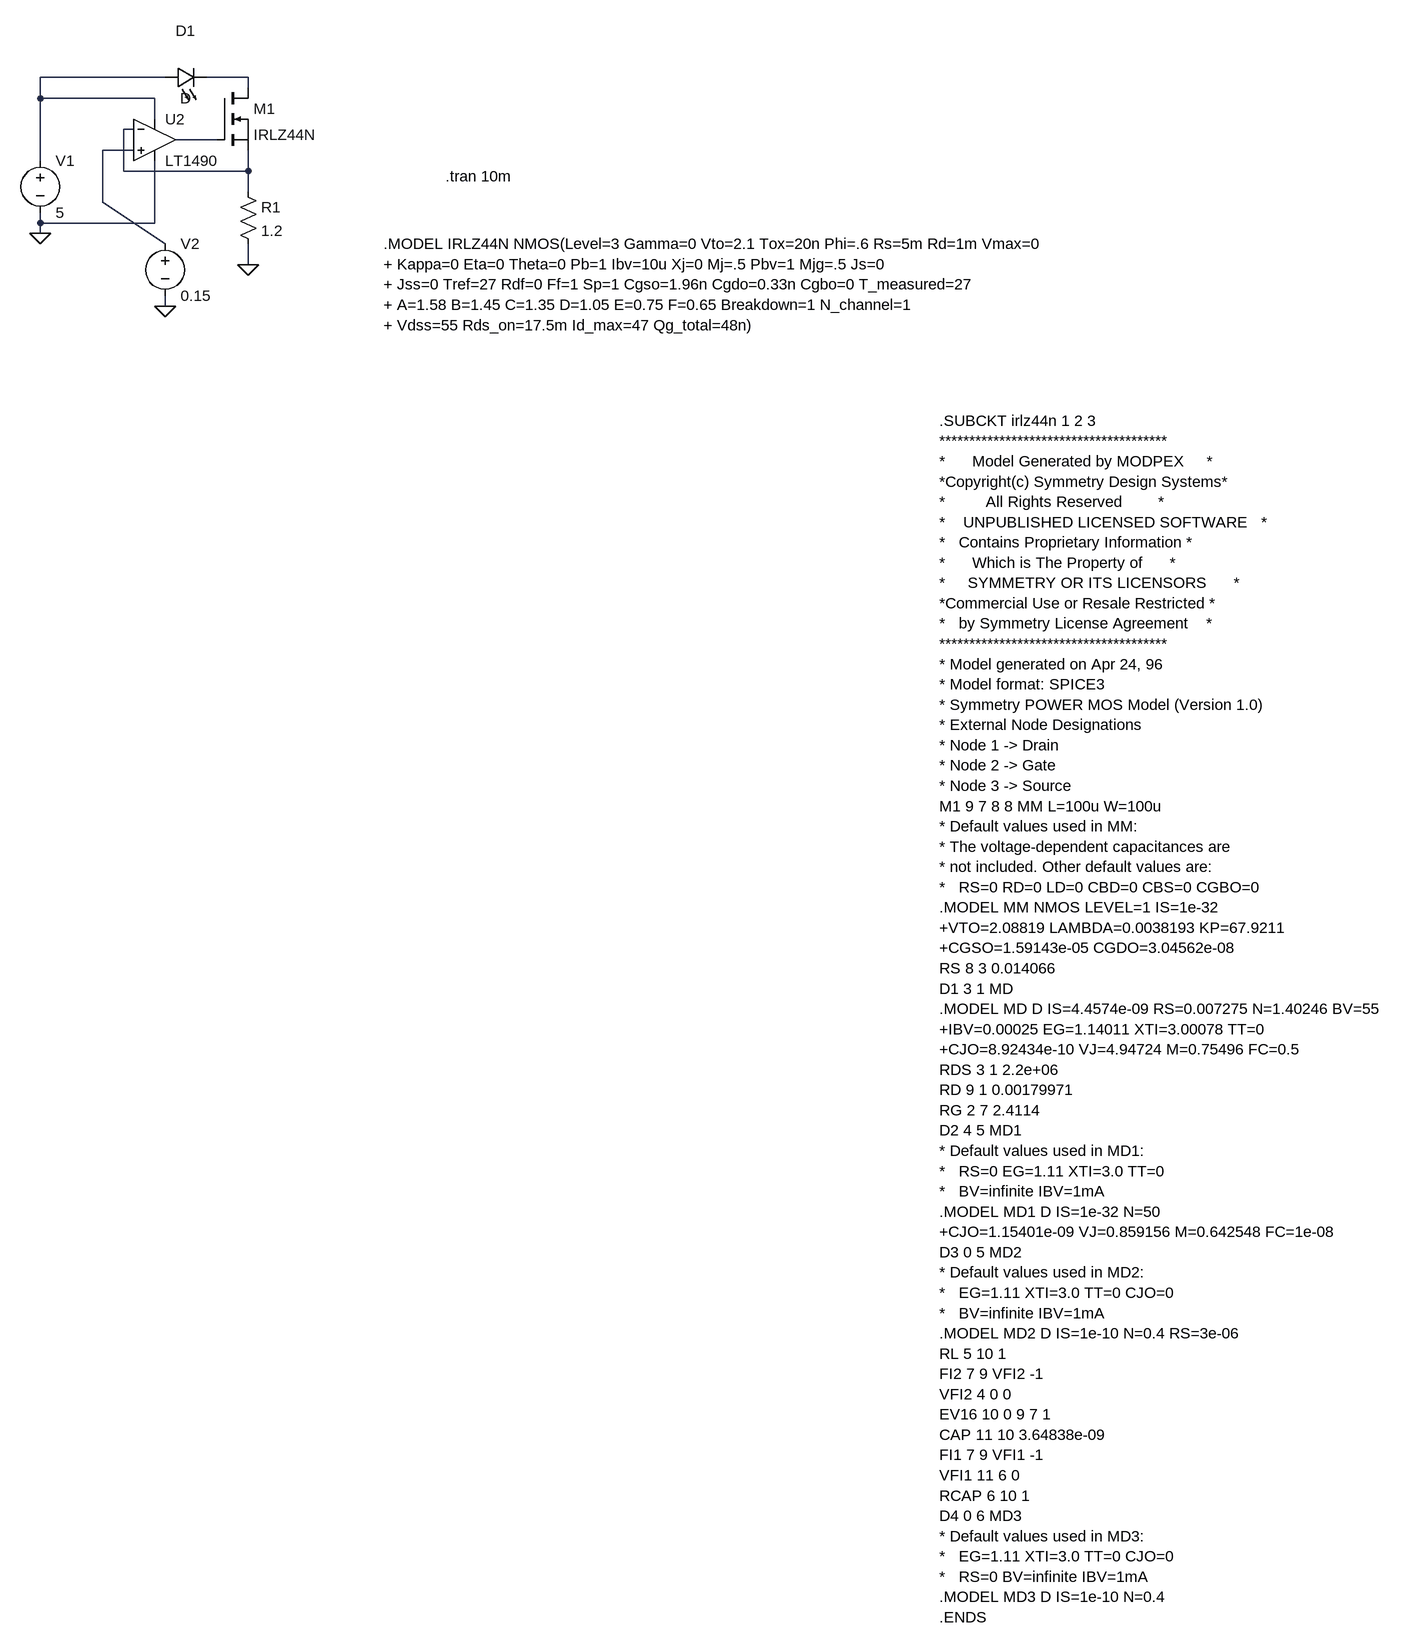
[diagram p0: schematic LED Current Driver Simulation.asc]
LED Current Driver Simulation.asc, the LTspice schematic file:
Version 4.1
SHEET 1 2040 2148
WIRE 112 -48 -80 -48
WIRE 240 -48 176 -48
WIRE 240 -32 240 -48
WIRE -80 -16 -80 -48
WIRE 96 -16 -80 -16
WIRE 96 16 96 -16
WIRE 64 32 48 32
WIRE 192 48 128 48
WIRE 64 64 16 64
WIRE -80 80 -80 -16
WIRE 48 96 48 32
WIRE 240 96 240 64
WIRE 240 96 48 96
WIRE 240 128 240 96
WIRE 16 144 16 64
WIRE -80 176 -80 160
WIRE 96 176 96 80
WIRE 96 176 -80 176
WIRE -80 192 -80 176
WIRE 112 208 16 144
WIRE 240 240 240 208
WIRE 112 304 112 288
FLAG 240 240 0
FLAG -80 192 0
FLAG 112 304 0
SYMBOL res 224 112 R0
SYMATTR InstName R1
SYMATTR Value 1.2
SYMBOL voltage -80 64 R0
WINDOW 123 0 0 Left 0
WINDOW 39 0 0 Left 0
SYMATTR InstName V1
SYMATTR Value 5
SYMBOL LED 112 -32 R270
WINDOW 0 72 32 VTop 2
WINDOW 3 0 32 VBottom 2
SYMATTR InstName D1
SYMBOL nmos 192 -32 R0
SYMATTR InstName M1
SYMATTR Value IRLZ44N
SYMATTR Prefix X
SYMBOL voltage 112 192 R0
WINDOW 123 0 0 Left 0
WINDOW 39 0 0 Left 0
SYMATTR InstName V2
SYMATTR Value 0.15
SYMBOL OpAmps\\LT1490 96 -16 R0
SYMATTR InstName U2
TEXT 544 104 Left 2 !.tran 10m
TEXT 448 208 Left 2 !.MODEL IRLZ44N NMOS(Level=3 Gamma=0 Vto=2.1 Tox=20n Phi=.6 Rs=5m Rd=1m Vmax=0 \n+ Kappa=0 Eta=0 Theta=0 Pb=1 Ibv=10u Xj=0 Mj=.5 Pbv=1 Mjg=.5 Js=0 \n+ Jss=0 Tref=27 Rdf=0 Ff=1 Sp=1 Cgso=1.96n Cgdo=0.33n Cgbo=0 T_measured=27 \n+ A=1.58 B=1.45 C=1.35 D=1.05 E=0.75 F=0.65 Breakdown=1 N_channel=1 \n+ Vdss=55 Rds_on=17.5m Id_max=47 Qg_total=48n)
TEXT 1304 480 Left 2 !.SUBCKT irlz44n 1 2 3\n**************************************\n*      Model Generated by MODPEX     *\n*Copyright(c) Symmetry Design Systems*\n*         All Rights Reserved        *\n*    UNPUBLISHED LICENSED SOFTWARE   *\n*   Contains Proprietary Information *\n*      Which is The Property of      *\n*     SYMMETRY OR ITS LICENSORS      *\n*Commercial Use or Resale Restricted *\n*   by Symmetry License Agreement    *\n**************************************\n* Model generated on Apr 24, 96\n* Model format: SPICE3\n* Symmetry POWER MOS Model (Version 1.0)\n* External Node Designations\n* Node 1 -> Drain\n* Node 2 -> Gate\n* Node 3 -> Source\nM1 9 7 8 8 MM L=100u W=100u\n* Default values used in MM:\n* The voltage-dependent capacitances are\n* not included. Other default values are:\n*   RS=0 RD=0 LD=0 CBD=0 CBS=0 CGBO=0\n.MODEL MM NMOS LEVEL=1 IS=1e-32\n+VTO=2.08819 LAMBDA=0.0038193 KP=67.9211\n+CGSO=1.59143e-05 CGDO=3.04562e-08\nRS 8 3 0.014066\nD1 3 1 MD\n.MODEL MD D IS=4.4574e-09 RS=0.007275 N=1.40246 BV=55\n+IBV=0.00025 EG=1.14011 XTI=3.00078 TT=0\n+CJO=8.92434e-10 VJ=4.94724 M=0.75496 FC=0.5\nRDS 3 1 2.2e+06\nRD 9 1 0.00179971\nRG 2 7 2.4114\nD2 4 5 MD1\n* Default values used in MD1:\n*   RS=0 EG=1.11 XTI=3.0 TT=0\n*   BV=infinite IBV=1mA\n.MODEL MD1 D IS=1e-32 N=50\n+CJO=1.15401e-09 VJ=0.859156 M=0.642548 FC=1e-08\nD3 0 5 MD2\n* Default values used in MD2:\n*   EG=1.11 XTI=3.0 TT=0 CJO=0\n*   BV=infinite IBV=1mA\n.MODEL MD2 D IS=1e-10 N=0.4 RS=3e-06\nRL 5 10 1\nFI2 7 9 VFI2 -1\nVFI2 4 0 0\nEV16 10 0 9 7 1\nCAP 11 10 3.64838e-09\nFI1 7 9 VFI1 -1\nVFI1 11 6 0\nRCAP 6 10 1\nD4 0 6 MD3\n* Default values used in MD3:\n*   EG=1.11 XTI=3.0 TT=0 CJO=0\n*   RS=0 BV=infinite IBV=1mA\n.MODEL MD3 D IS=1e-10 N=0.4\n.ENDS

The netlist it stands for:
* LED Current Driver Simulation.asc
R1 N003 0 1.2
V1 N001 0 5
D1 N001 N002 D
X§M1 N002 N004 N003 IRLZ44N  ; pins D G S
V2 N005 0 0.15
X§U2 N005 N003 N001 0 N004 LT1490  ; pins In+ In- V+ V- OUT
.model D D
.lib standard.dio
.tran 10m
.MODEL IRLZ44N NMOS(Level=3 Gamma=0 Vto=2.1 Tox=20n Phi=.6 Rs=5m Rd=1m Vmax=0
+ Kappa=0 Eta=0 Theta=0 Pb=1 Ibv=10u Xj=0 Mj=.5 Pbv=1 Mjg=.5 Js=0
+ Jss=0 Tref=27 Rdf=0 Ff=1 Sp=1 Cgso=1.96n Cgdo=0.33n Cgbo=0 T_measured=27
+ A=1.58 B=1.45 C=1.35 D=1.05 E=0.75 F=0.65 Breakdown=1 N_channel=1
+ Vdss=55 Rds_on=17.5m Id_max=47 Qg_total=48n)
.SUBCKT irlz44n 1 2 3
**************************************
*      Model Generated by MODPEX     *
*Copyright(c) Symmetry Design Systems*
*         All Rights Reserved        *
*    UNPUBLISHED LICENSED SOFTWARE   *
*   Contains Proprietary Information *
*      Which is The Property of      *
*     SYMMETRY OR ITS LICENSORS      *
*Commercial Use or Resale Restricted *
*   by Symmetry License Agreement    *
**************************************
* Model generated on Apr 24, 96
* Model format: SPICE3
* Symmetry POWER MOS Model (Version 1.0)
* External Node Designations
* Node 1 -> Drain
* Node 2 -> Gate
* Node 3 -> Source
M1 9 7 8 8 MM L=100u W=100u
* Default values used in MM:
* The voltage-dependent capacitances are
* not included. Other default values are:
*   RS=0 RD=0 LD=0 CBD=0 CBS=0 CGBO=0
.MODEL MM NMOS LEVEL=1 IS=1e-32
+VTO=2.08819 LAMBDA=0.0038193 KP=67.9211
+CGSO=1.59143e-05 CGDO=3.04562e-08
RS 8 3 0.014066
D1 3 1 MD
.MODEL MD D IS=4.4574e-09 RS=0.007275 N=1.40246 BV=55
+IBV=0.00025 EG=1.14011 XTI=3.00078 TT=0
+CJO=8.92434e-10 VJ=4.94724 M=0.75496 FC=0.5
RDS 3 1 2.2e+06
RD 9 1 0.00179971
RG 2 7 2.4114
D2 4 5 MD1
* Default values used in MD1:
*   RS=0 EG=1.11 XTI=3.0 TT=0
*   BV=infinite IBV=1mA
.MODEL MD1 D IS=1e-32 N=50
+CJO=1.15401e-09 VJ=0.859156 M=0.642548 FC=1e-08
D3 0 5 MD2
* Default values used in MD2:
*   EG=1.11 XTI=3.0 TT=0 CJO=0
*   BV=infinite IBV=1mA
.MODEL MD2 D IS=1e-10 N=0.4 RS=3e-06
RL 5 10 1
FI2 7 9 VFI2 -1
VFI2 4 0 0
EV16 10 0 9 7 1
CAP 11 10 3.64838e-09
FI1 7 9 VFI1 -1
VFI1 11 6 0
RCAP 6 10 1
D4 0 6 MD3
* Default values used in MD3:
*   EG=1.11 XTI=3.0 TT=0 CJO=0
*   RS=0 BV=infinite IBV=1mA
.MODEL MD3 D IS=1e-10 N=0.4
.ENDS
.backanno
.end